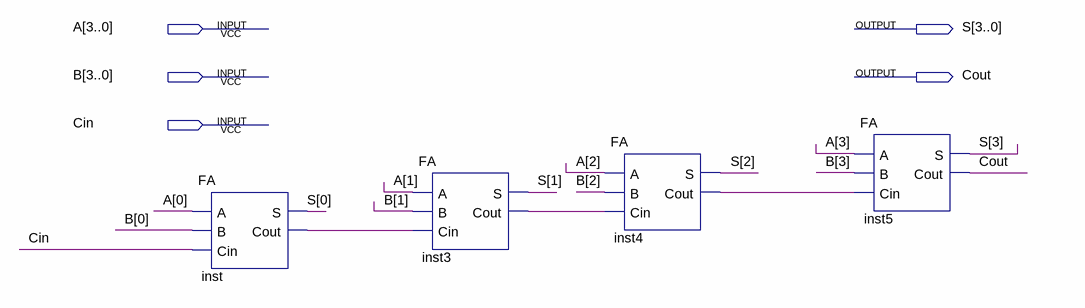
[diagram p0: schematic sheet]
// Quartus schematic RCA4.bdf as structural Verilog: 4 symbols, 5 pins
module RCA4 (
  input  [3:0] A,
  input  [3:0] B,
  input  Cin,
  output [3:0] S,
  output Cout
);

  wire inst3_cout, inst4_cout, inst_cout;

  FA inst (.A(A[0]), .B(B[0]), .Cin(Cin), .S(S[0]), .Cout(inst_cout));
  FA inst3 (.A(A[1]), .B(B[1]), .Cin(inst_cout), .S(S[1]), .Cout(inst3_cout));
  FA inst4 (.A(A[2]), .B(B[2]), .Cin(inst3_cout), .S(S[2]), .Cout(inst4_cout));
  FA inst5 (.A(A[3]), .B(B[3]), .Cin(inst4_cout), .S(S[3]), .Cout(Cout));
endmodule
